# Altium project SynchroLightSlave_V2.PrjPcb
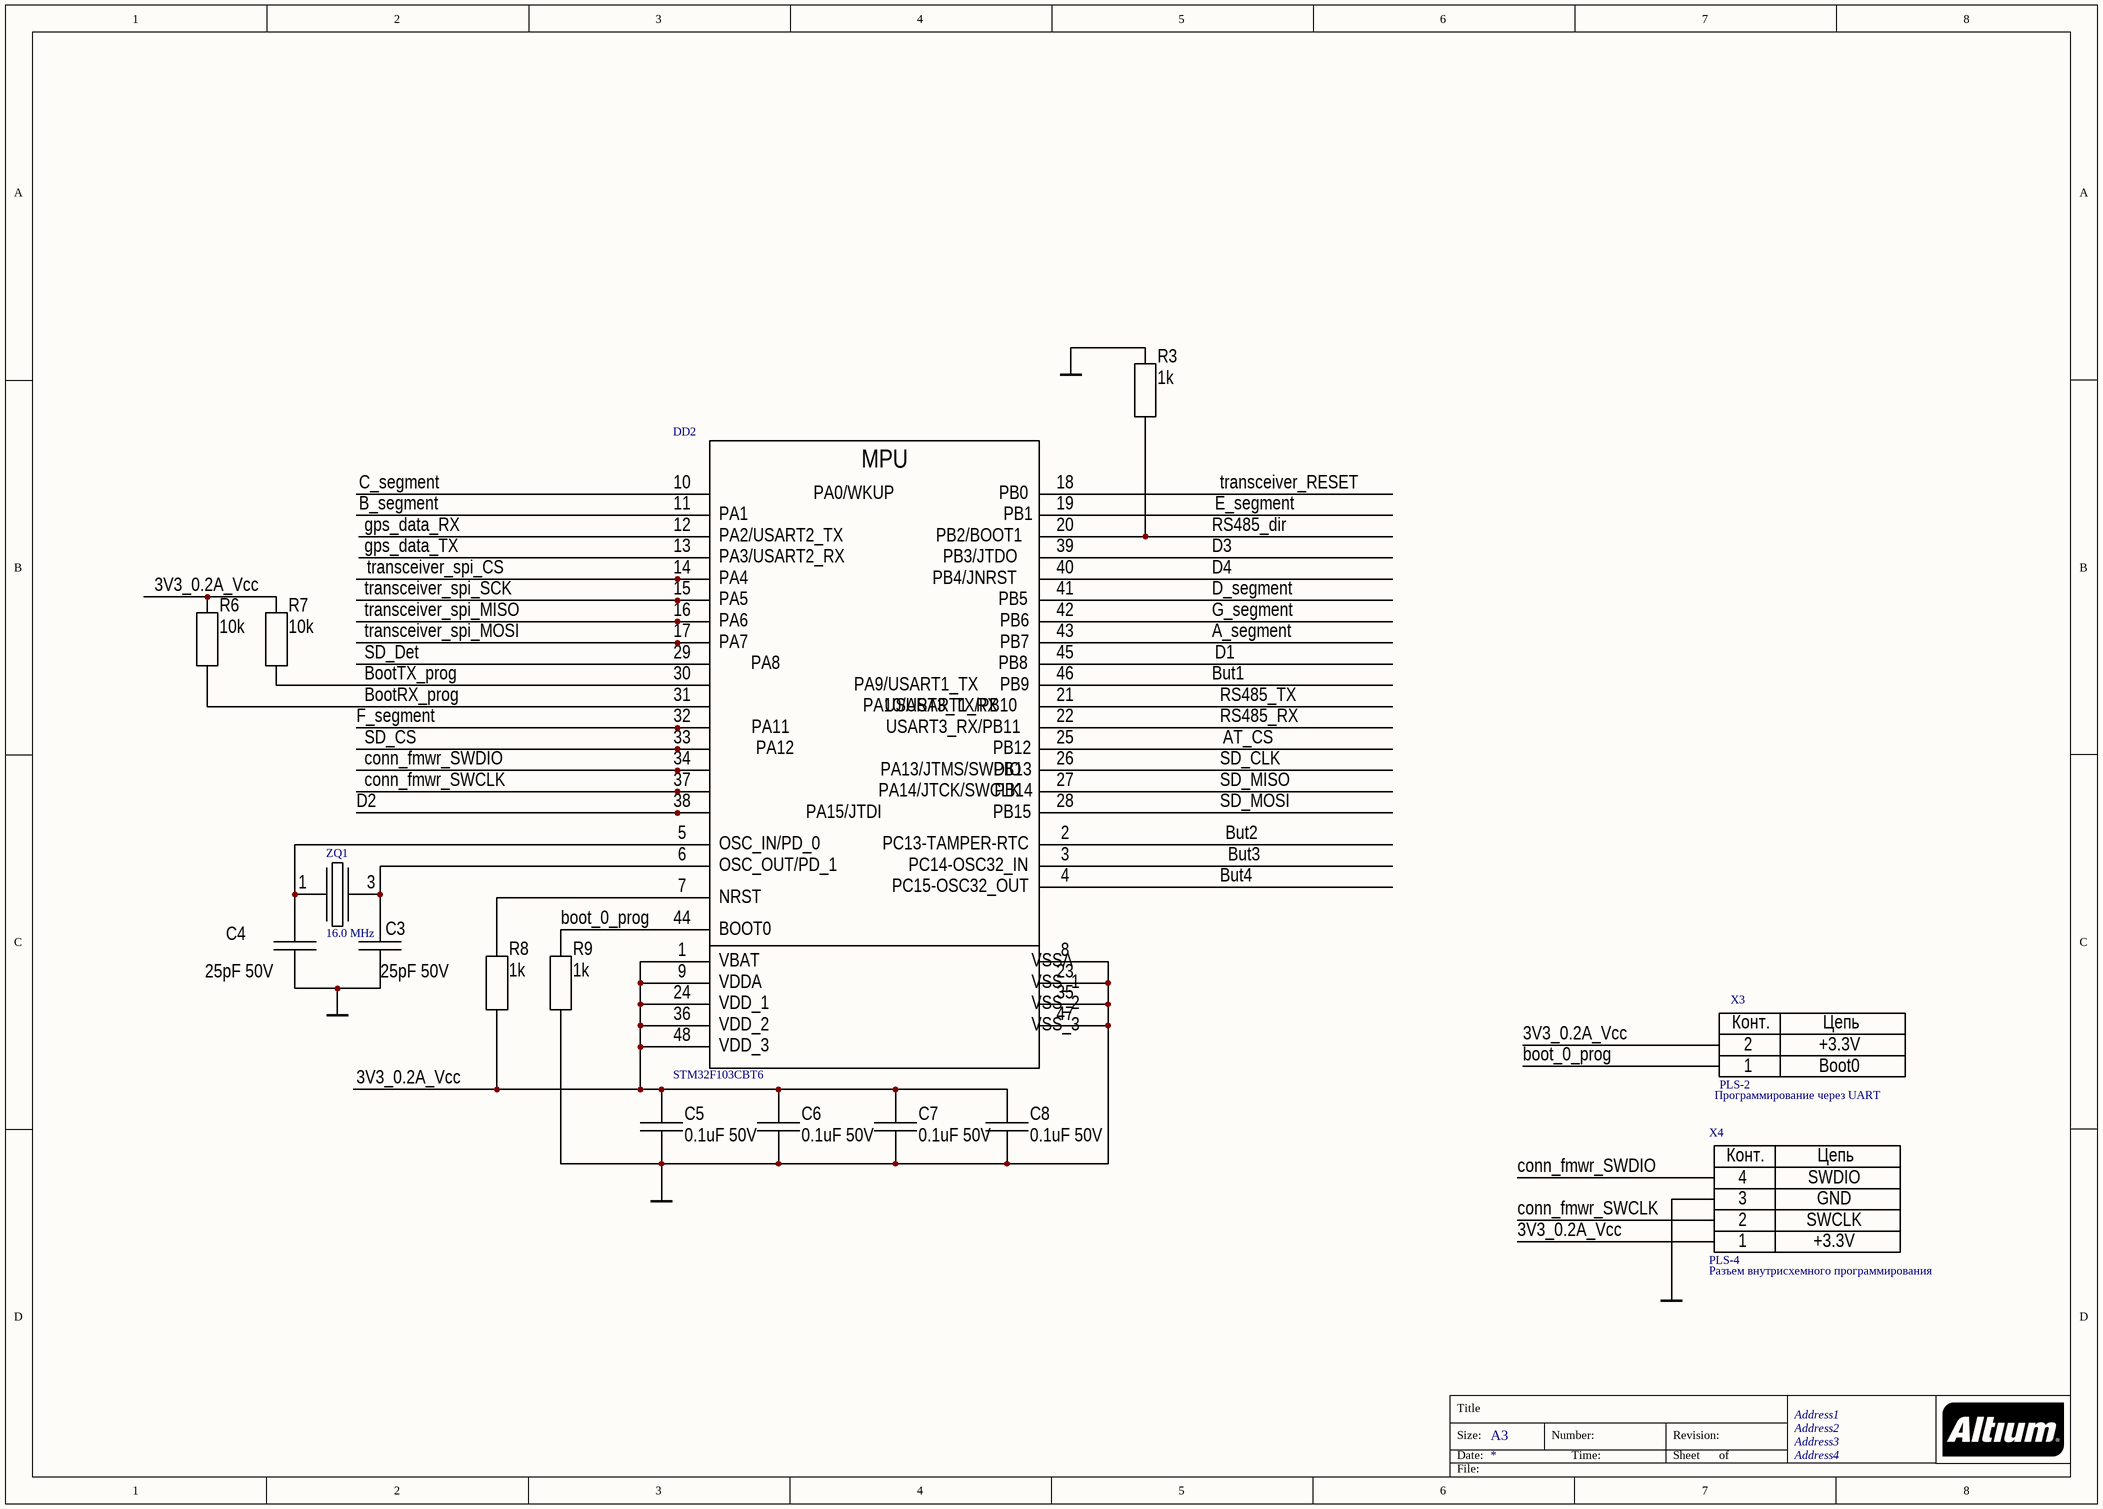
[diagram p0: MCU.SchDoc]
6 sheets, 86 parts. Net scope: global (net labels, ports and power ports of the same name join across sheets).
Board file: SynchroLightSlave_V2.PcbDoc
Sheets:
  MCU.SchDoc
  Transceiver.SchDoc
  RS485_USB.SchDoc
  LCD_SD.SchDoc
  Power.SchDoc
  Adapter.SchDoc

## Sheet MCU.SchDoc
size A3; Address1: Address1; Address2: Address2; Address3: Address3; Address4: Address4

### Parts
C3  25pF 50V  [0805_CAP]
C4  25pF 50V  [0805_CAP]
C5  0.1uF 50V  [0805_CAP]
C6  0.1uF 50V  [0805_CAP]
C7  0.1uF 50V  [0805_CAP]
C8  0.1uF 50V  [0805_CAP]
DD2  STM32F103CBT6  [Lqfp-48]
R3  1k  [0805_RES]
R6  10k  [0805_RES]
R7  10k  [0805_RES]
R8  1k  [0805_RES]
R9  1k  [0805_RES]
X3  PLS-2  Destiny: Программирование через UART  [PLS-2-2.54]
X4  PLS-4  Destiny: Разъем внутрисхемного программирования  [PLS-4-2.54]
ZQ1  16.0 MHz  [HC-49]

### Nets
GND: C3.1 C4.1 C5.1 C6.1 C7.1 C8.1 DD2.8 DD2.23 DD2.35 DD2.47 R3.2 R9.1 X4.3
3V3_0.2A_Vcc: C5.2 C6.2 C7.2 C8.2 DD2.1 DD2.9 DD2.24 DD2.36 DD2.48 R6.2 R7.2 R8.1 X3.2 X4.1
A_segment: DD2.43
AT_CS: DD2.25
B_segment: DD2.11
boot_0_prog: DD2.44 R9.2 X3.1
BootRX_prog: DD2.31 R6.1
BootTX_prog: DD2.30 R7.1
But1: DD2.46
But2: DD2.2
But3: DD2.3
But4: DD2.4
C_segment: DD2.10
conn_fmwr_SWCLK: DD2.37 X4.2
conn_fmwr_SWDIO: DD2.34 X4.4
D1: DD2.45
D2: DD2.38
D3: DD2.39
D4: DD2.40
D_segment: DD2.41
E_segment: DD2.19
F_segment: DD2.32
G_segment: DD2.42
gps_data_RX: DD2.12
gps_data_TX: DD2.13
RS485_dir: DD2.20 R3.1
RS485_RX: DD2.22
RS485_TX: DD2.21
SD_CLK: DD2.26
SD_CS: DD2.33
SD_Det: DD2.29
SD_MISO: DD2.27
SD_MOSI: DD2.28
transceiver_RESET: DD2.18
transceiver_spi_CS: DD2.14
transceiver_spi_MISO: DD2.16
transceiver_spi_MOSI: DD2.17
transceiver_spi_SCK: DD2.15
NetC3_2: C3.2 DD2.6 ZQ1.3
NetC4_2: C4.2 DD2.5 ZQ1.1
NetDD2_7: DD2.7 R8.2

### Notes on the sheet
- Title
- Size:
- Date:
- A3
- Number:
- Time:
- Revision:
- Sheet
- of
- File:
- (in symbol 2pin_conn) Конт.; Цепь
- (in symbol 4pin_conn) Конт.; Цепь
- (in symbol STM32F103-48) MPU; PA0/WKUP; PB0; PA1; PB1; PA2/USART2_TX; PB2/BOOT1; PA3/USART2_RX; PB3/JTDO; PA4; PB4/JNRST; PA5; PB5; PA6; PB6; PA7; PB7; PA8; PB8; PA9/USART1_TX; PB9; PA10/USART1_RX; USART3_TX/PB10; PA11; USART3_RX/PB11; PA12; PB12; PA13/JTMS/SWDIO; PB13; PA14/JTCK/SWCLK; PB14; PA15/JTDI; PB15; OSC_IN/PD_0; PC13-TAMPER-RTC; OSC_OUT/PD_1; PC14-OSC32_IN; PC15-OSC32_OUT; NRST; BOOT0; VBAT; VSSA; VDDA; VSS_1; VDD_1; VSS_2; VDD_2; VSS_3; VDD_3

### Library data of the parts
C3-C8 = Cap_np
  C3 C4: Value: 25pF 50V
  C5-C8: Value: 0.1uF 50V
DD2 = STM32F103-48: Value: STM32F103CBT6
R3 R6-R9 = Res
  R3 R8 R9: Value: 1k
  R6 R7: Value: 10k
X3 = 2pin_conn: PinName2: +3.3V; PinName1: Boot0; Value: PLS-2
X4 = 4pin_conn: PinName1: +3.3V; PinName2: SWCLK; PinName3: GND; PinName4: SWDIO; Value: PLS-4
ZQ1 = Cristall: Value: 16.0 MHz

## Sheet Transceiver.SchDoc
size A3; Address1: Address1; Address2: Address2; Address3: Address3; Address4: Address4
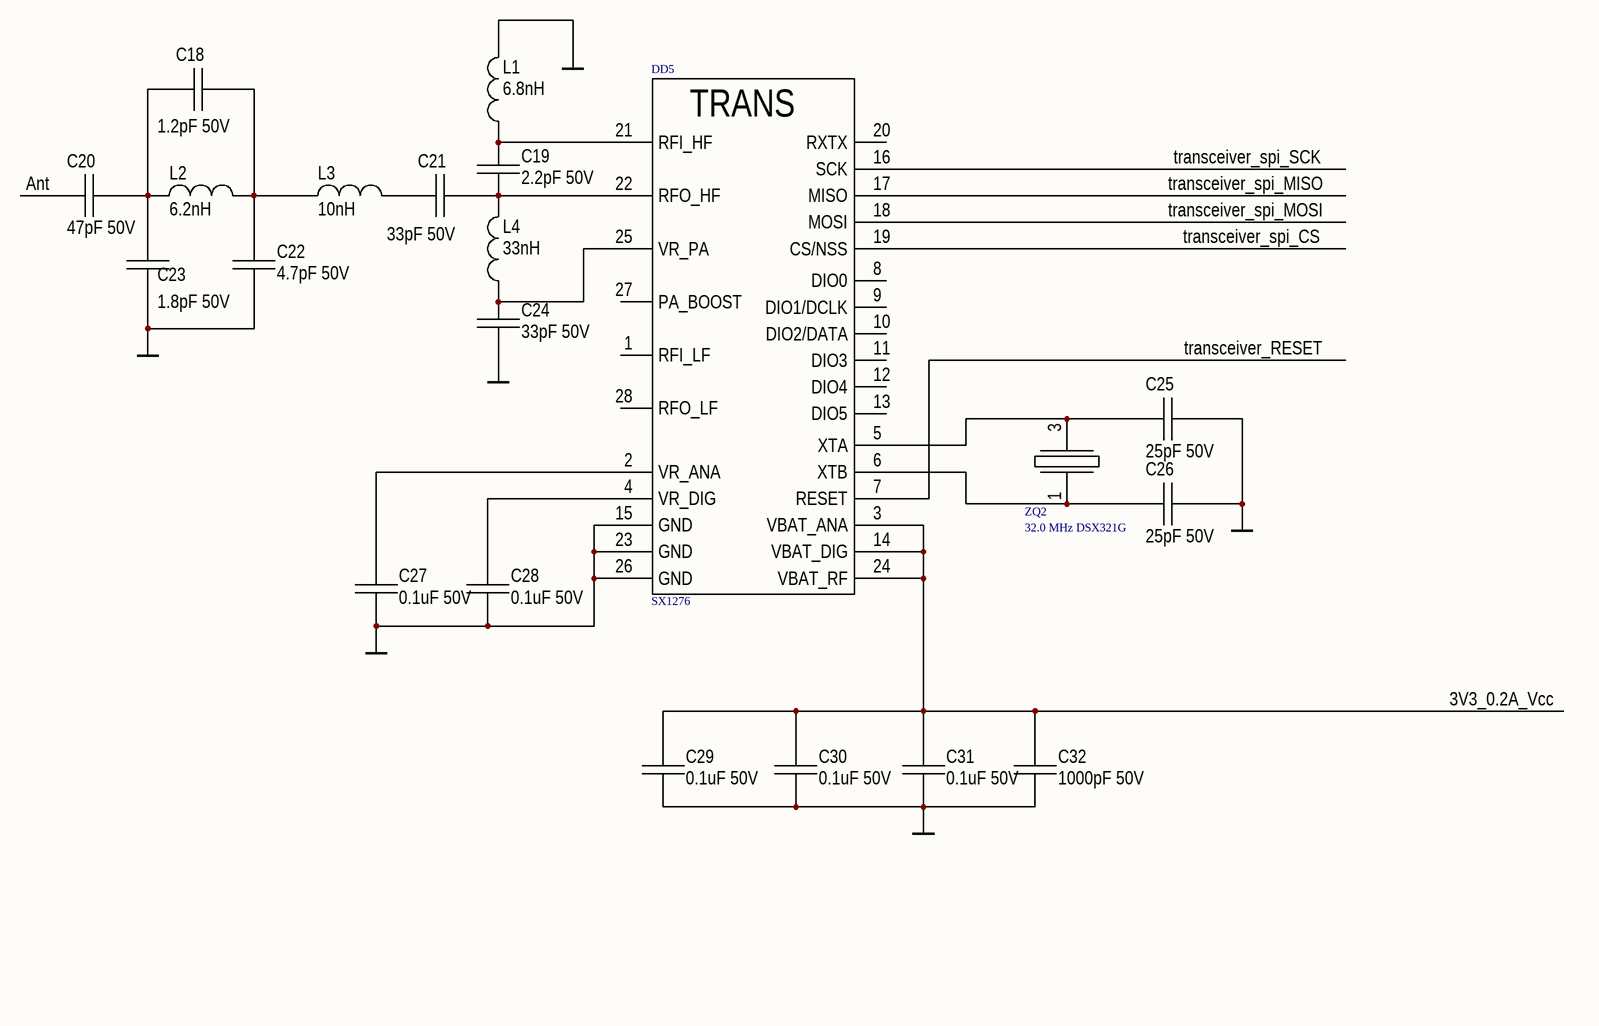
[diagram p1: Transceiver.SchDoc]

### Parts
C18  1.2pF 50V  [0603_CAP]
C19  2.2pF 50V  [0603_CAP]
C20  47pF 50V  [0603_CAP]
C21  33pF 50V  [0603_CAP]
C22  4.7pF 50V  [0603_CAP]
C23  1.8pF 50V  [0603_CAP]
C24  33pF 50V  [0603_CAP]
C25  25pF 50V  [0805_CAP]
C26  25pF 50V  [0805_CAP]
C27  0.1uF 50V  [0805_CAP]
C28  0.1uF 50V  [0805_CAP]
C29  0.1uF 50V  [0805_CAP]
C30  0.1uF 50V  [0805_CAP]
C31  0.1uF 50V  [0805_CAP]
C32  1000pF 50V  [0805_CAP]
DD5  SX1276  [qfn28]
L1  6.8nH  [0603_ind]
L2  6.2nH  [0603_ind]
L3  10nH  [0603_ind]
L4  33nH  [0603_ind]
ZQ2  32.0 MHz DSX321G  [gtxo-93]

### Nets
GND: C22.2 C23.1 C24.2 C25.2 C26.2 C27.1 C28.2 C29.2 C30.2 C31.2 C32.2 DD5.15(GND) DD5.23(GND) DD5.26(GND) L1.2
3V3_0.2A_Vcc: C29.1 C30.1 C31.1 C32.1 DD5.3(VBAT_ANA) DD5.14(VBAT_DIG) DD5.24(VBAT_RF)
Ant: C20.2
transceiver_RESET: DD5.7(RESET)
transceiver_spi_CS: DD5.19(CS/NSS)
transceiver_spi_MISO: DD5.17(MISO)
transceiver_spi_MOSI: DD5.18(MOSI)
transceiver_spi_SCK: DD5.16(SCK)
NetC18_1: C18.1 C20.1 C23.2 L2.1
NetC18_2: C18.2 C22.1 L2.2 L3.1
NetC19_1: C19.1 C21.1 DD5.22(RFO_HF) L4.2
NetC19_2: C19.2 DD5.21(RFI_HF) L1.1
NetC21_2: C21.2 L3.2
NetC24_1: C24.1 DD5.25(VR_PA) L4.1
NetC25_1: C25.1 DD5.5(XTA) ZQ2.3
NetC26_1: C26.1 DD5.6(XTB) ZQ2.1
NetC27_2: C27.2 DD5.2(VR_ANA)
NetC28_1: C28.1 DD5.4(VR_DIG)

Not connected (* = marked no-connect by the designer): DD5 1(RFI_LF) 8(DIO0) 9(DIO1/DCLK) 10(DIO2/DATA) 11(DIO3) 12(DIO4) 13(DIO5) 20(RXTX) 27(PA_BOOST) 28(RFO_LF)

### Notes on the sheet
- На место компонента С6 запаивается перемычка
- Title
- Size:
- Date:
- A3
- Number:
- Time:
- Revision:
- Sheet
- of
- File:
- (in symbol SX1276) TRANS

### Library data of the parts
C18-C32 = Cap_np
  C18: Value: 1.2pF 50V
  C19: Value: 2.2pF 50V
  C20: Value: 47pF 50V
  C21 C24: Value: 33pF 50V
  C22: Value: 4.7pF 50V
  C23: Value: 1.8pF 50V
  C25 C26: Value: 25pF 50V
  C27-C31: Value: 0.1uF 50V
  C32: Value: 1000pF 50V
L1-L4 = Inductor
  L1: Value: 6.8nH
  L2: Value: 6.2nH
  L3: Value: 10nH
  L4: Value: 33nH
ZQ2 = Cristall: Value: 32.0 MHz DSX321G
DD5 = SX1276: Value: SX1276

## Sheet RS485_USB.SchDoc
size A3; Address1: Address1; Address2: Address2; Address3: Address3; Address4: Address4
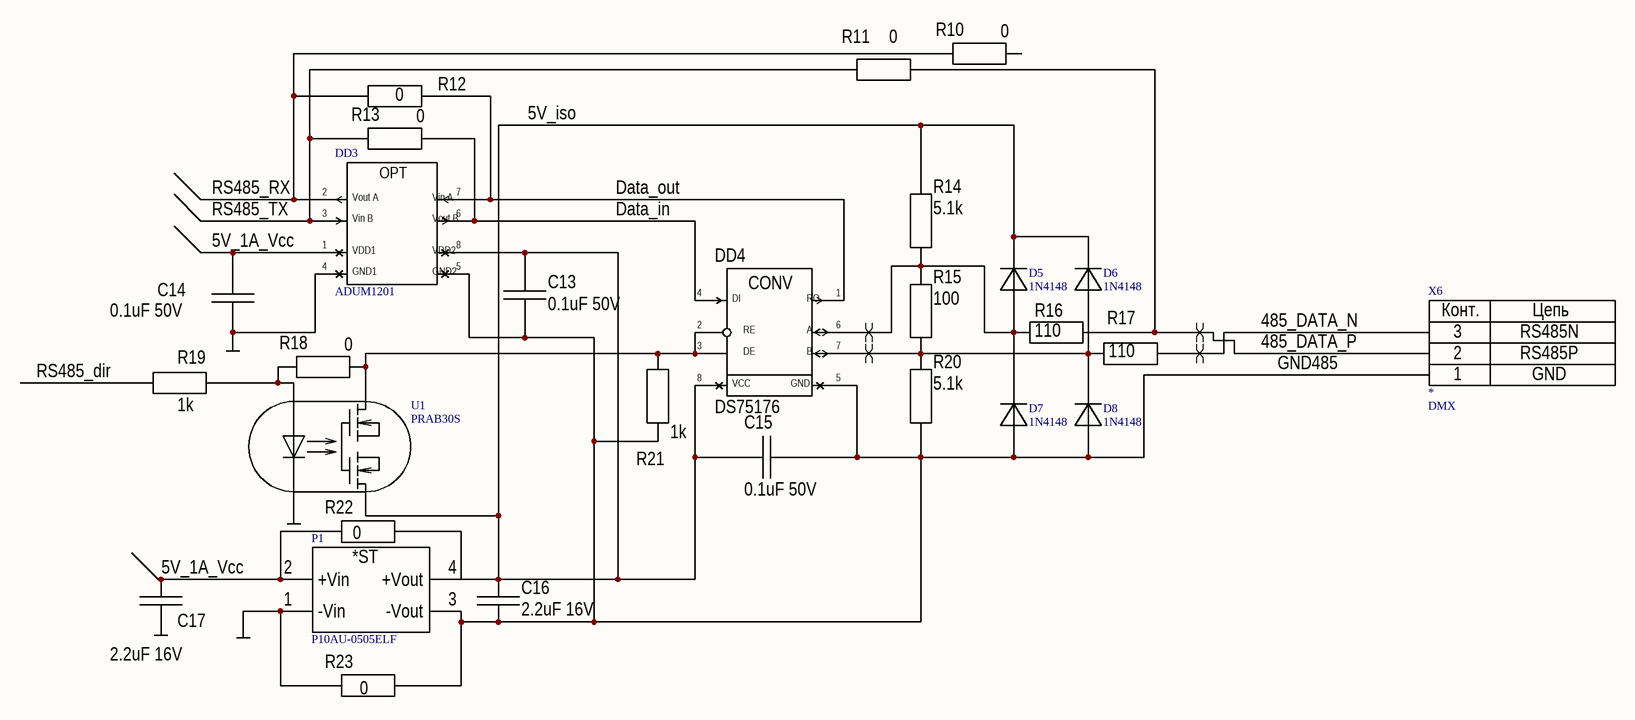
[diagram p2: RS485_USB.SchDoc]

### Parts
C13  0.1uF 50V  [0805_CAP]
C14  0.1uF 50V  [0805_CAP]
C15  0.1uF 50V  [0805_CAP]
C16  2.2uF 16V  [0805_CAP]
C17  2.2uF 16V  [0805_CAP]
D5  1N4148  [sod80c]
D6  1N4148  [sod80c]
D7  1N4148  [sod80c]
D8  1N4148  [sod80c]
DD3  ADUM1201  [soic-8]
DD4  DS75176  [soic-8]
P1  P10AU-0505ELF  [SIP4]
R10  0  [0805_RES]
R11  0  [0805_RES]
R12  0  [0805_RES]
R13  0  [0805_RES]
R14  5.1k  [0805_RES]
R15  100  [0805_RES]
R16  110  [0805_RES]
R17  110  [0805_RES]
R18  0  [0805_RES]
R19  1k  [0805_RES]
R20  5.1k  [0805_RES]
R21  1k  [0805_RES]
R22  0  [0805_RES]
R23  0  [0805_RES]
U1  PRAB30S  [sop4_optocoup]
X6  *  Destiny: DMX  [3pad_5.08]

### Nets
GND: C14.2 C17.1 DD3.4 P1.1(-Vin) R23.1 U1.2(C)
5V_1A_Vcc: C14.1 C17.2 DD3.1(A1) P1.2(+Vin) R22.1
5V_iso: C13.1 C15.1 C16.2 D5.2 D6.2 DD3.8 DD4.8 P1.4(+Vout) R14.1 R22.2 U1.3(E)
485_DATA_N: R17.2 X6.3
485_DATA_P: R11.2 R16.2 X6.2
Data_in: DD3.6 DD4.4 R13.2
Data_out: DD3.7 DD4.1 R12.2
GND485: C13.2 C15.2 C16.1 D7.1 D8.1 DD3.5 DD4.5 P1.3(-Vout) R20.2 R21.2 R23.2 X6.1
RS485_dir: R19.1
RS485_RX: DD3.2 R10.1 R12.1
RS485_TX: DD3.3 R11.1 R13.1
NetD5_1: D5.1 D7.2 DD4.6 R14.2 R15.1 R16.1
NetD6_1: D6.1 D8.2 DD4.7 R15.2 R17.1 R20.1
NetDD4_2: DD4.2 DD4.3 R18.2 R21.1 U1.4(C)
NetR18_1: R18.1 R19.2 U1.1(A)

Not connected (* = marked no-connect by the designer): R10 2

### Layout directives
differential pair: 485_DATA_N, 485_DATA_P, NetD5_1, NetD6_1

### Notes on the sheet
- Title
- Size:
- Date:
- A3
- Number:
- Time:
- Revision:
- Sheet
- of
- File:
- (in symbol 3pin_conn) Конт.; Цепь
- (in symbol ADUM1201) OPT; Vout A; Vin A; Vin B; Vout B; VDD1; VDD2; GND1; GND2
- (in symbol ds75176) CONV; DI; RO; RE; A; DE; B; VCC; GND
- (in symbol P10AU) *ST

### Library data of the parts
C13-C17 = Cap_np
  C13-C15: Value: 0.1uF 50V
  C16 C17: Value: 2.2uF 16V
D5-D8 = Diode: Value: 1N4148
P1 = P10AU: Value: P10AU-0505ELF
R10-R23 = Res
  R10-R13 R18 R22 R23: Value: 0
  R14 R20: Value: 5.1k
  R15: Value: 100
  R16 R17: Value: 110
  R19 R21: Value: 1k
U1 = Opto_Realy: Value: PRAB30S
X6 = 3pin_conn: PinName1: GND; PinName2: RS485P; PinName3: RS485N; Value: *
DD3 = ADUM1201: Value: ADUM1201
DD4 = ds75176: Value: DS75176

## Sheet LCD_SD.SchDoc
size A3; Address1: Address1; Address2: Address2; Address3: Address3; Address4: Address4
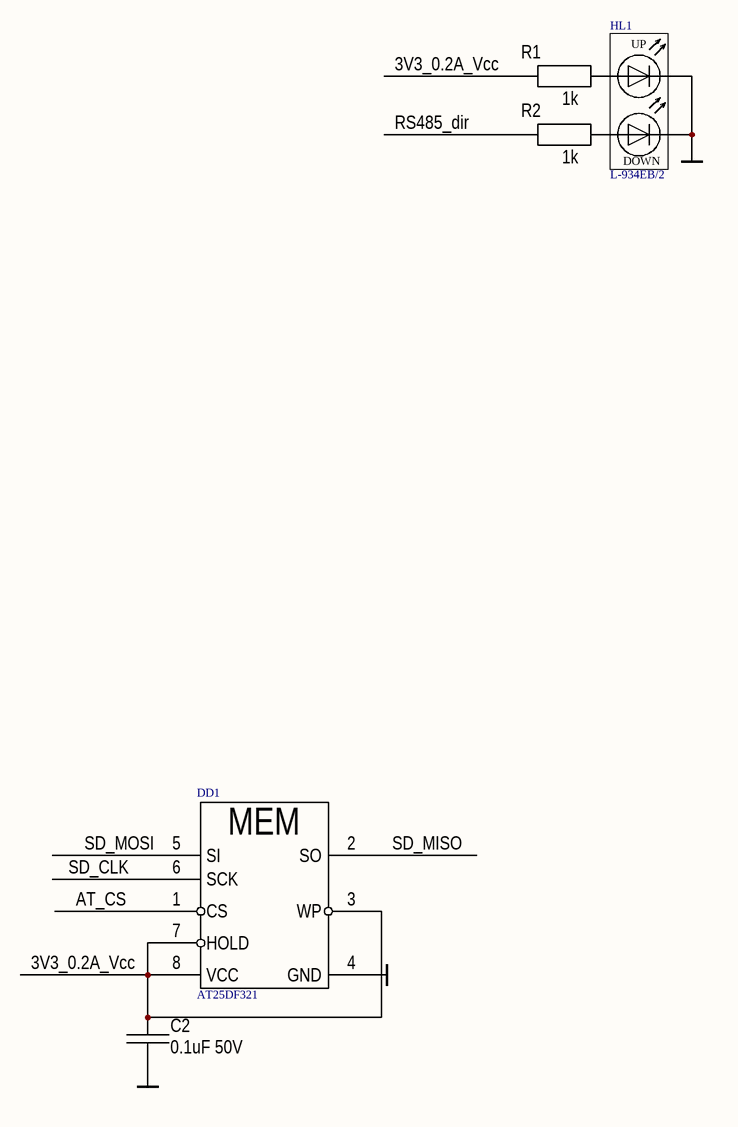
[diagram p3: LCD_SD.SchDoc]

### Parts
C2  0.1uF 50V  [0805_CAP]
DD1  AT25DF321  [soic8-200]
HL1  L-934EB/2  [L-934EB/2]
R1  1k  [0805_RES]
R2  1k  [0805_RES]

### Nets
GND: C2.2 DD1.4(GND) HL1.1 HL1.3
3V3_0.2A_Vcc: C2.1 DD1.3(WP) DD1.7(HOLD) DD1.8(VCC) R1.2
AT_CS: DD1.1(CS)
RS485_dir: R2.2
SD_CLK: DD1.6(SCK)
SD_MISO: DD1.2(SO)
SD_MOSI: DD1.5(SI)
NetHL1_2: HL1.2 R2.1
NetHL1_4: HL1.4 R1.1

### Notes on the sheet
- Title
- Size:
- Date:
- A3
- Number:
- Time:
- Revision:
- Sheet
- of
- File:
- (in symbol AT25DF321) MEM
- (in symbol LEDx2) UP; DOWN

### Library data of the parts
C2 = Cap_np: Value: 0.1uF 50V
HL1 = LEDx2: Value: L-934EB/2
R1 R2 = Res: Value: 1k
DD1 = AT25DF321: Value: AT25DF321

## Sheet Power.SchDoc
size A4
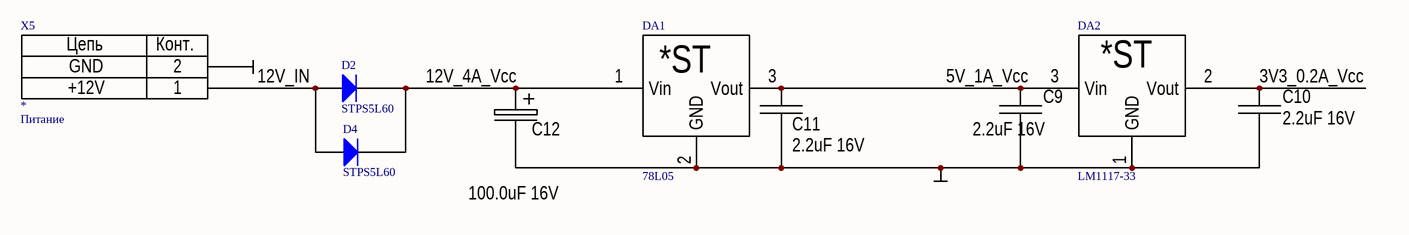
[diagram p4: Power.SchDoc]

### Parts
C9  2.2uF 16V  [0805_CAP]
C10  2.2uF 16V  [0805_CAP]
C11  2.2uF 16V  [0805_CAP]
C12  100.0uF 16V  [CAP_P_8mm_3.5mm]
D2  STPS5L60  [SMC]
D4  STPS5L60  [SMC]
DA1  78L05  [to-220ab]
DA2  LM1117-33  [dpack]
X5  *  Destiny: Питание  [2pin_5.08]

### Nets
GND: C9.1 C10.1 C11.1 C12.2 DA1.2(GND) DA2.1(GND) X5.2
3V3_0.2A_Vcc: C10.2 DA2.2(Vout)
5V_1A_Vcc: C9.2 C11.2 DA1.3(Vout) DA2.3(Vin)
12V_4A_Vcc: C12.1 D2.2(K) D4.2(K) DA1.1(Vin)
12V_IN: D2.1(A) D4.1(A) X5.1

### Notes on the sheet
- (in symbol 2pin_conn) Цепь; Конт.
- (in symbol 78L05) *ST
- (in symbol LM1117) *ST

### Library data of the parts
C9-C11 = Cap_np: Value: 2.2uF 16V
C12 = Cap_p: Group: Passive; Value: 100.0uF 16V
D2 D4 = Diode: Default Diode; Published: 8-Jun-2000; LatestRevisionDate: 17-Jul-2002; LatestRevisionNote: Re-released for DXP Platform.; PackageVersion: Sep-1996; PackageReference: SMC; Publisher: Altium Limited; PackageDescription: DO-214-AB/SMC; 2 C-Bend Leads; Body 7.9 x 5.9 mm, inc. leads (LxW); Code_JEDEC: DO-214-AB
DA2 = LM1117: Value: LM1117-33
X5 = 2pin_conn: PinName2: GND; PinName1: +12V; Value: *
DA1 = 78L05: Value: 78L05

## Sheet Adapter.SchDoc
size A3; Address1: Address1; Address2: Address2; Address3: Address3; Address4: Address4
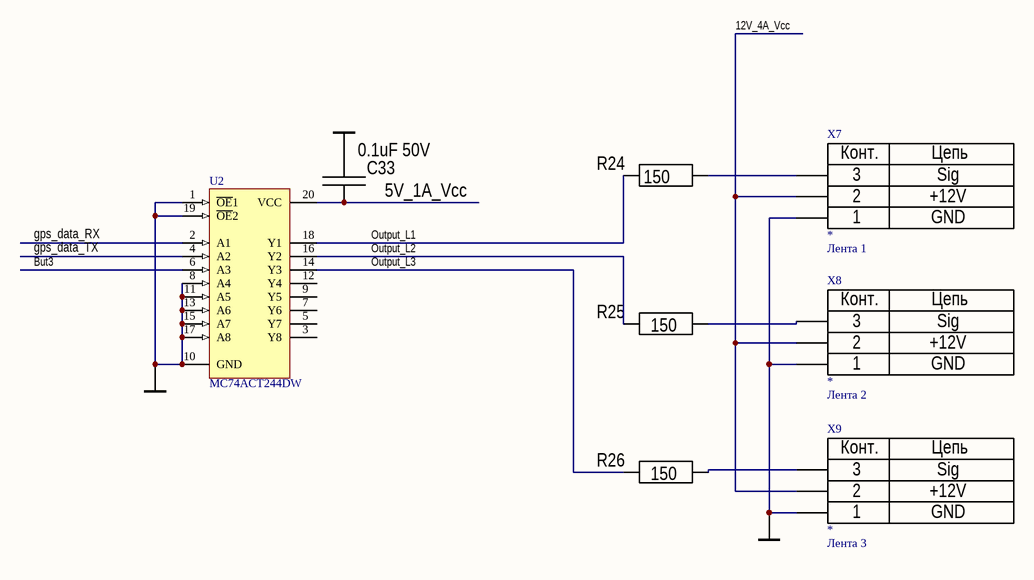
[diagram p5: Adapter.SchDoc]

### Parts
C33  0.1uF 50V  [0805_CAP]
R24  150  [0805_RES]
R25  150  [0805_RES]
R26  150  [0805_RES]
U2  MC74ACT244DW  [751D-04_N]
X7  *  Destiny: Лента 1  [3pad_5.08]
X8  *  Destiny: Лента 2  [3pad_5.08]
X9  *  Destiny: Лента 3  [3pad_5.08]

### Nets
GND: C33.2 U2.1(~{OE}1) U2.8(A4) U2.10(GND) U2.11(A5) U2.13(A6) U2.15(A7) U2.17(A8) U2.19(~{OE}2) X7.1 X8.1 X9.1
5V_1A_Vcc: C33.1 U2.20(VCC)
12V_4A_Vcc: X7.2 X8.2 X9.2
But3: U2.6(A3)
gps_data_RX: U2.2(A1)
gps_data_TX: U2.4(A2)
Output_L1: R24.1 U2.18(Y1)
Output_L2: R25.1 U2.16(Y2)
Output_L3: R26.1 U2.14(Y3)
NetR24_2: R24.2 X7.3
NetR25_2: R25.2 X8.3
NetR26_2: R26.2 X9.3

Not connected (* = marked no-connect by the designer): U2 3(Y8) 5(Y7) 7(Y6) 9(Y5) 12(Y4)

### Notes on the sheet
- Title
- Size:
- Date:
- A3
- Number:
- Time:
- Revision:
- Sheet
- of
- File:
- (in symbol 3pin_conn) Конт.; Цепь

### Library data of the parts
C33 = Cap_np: Value: 0.1uF 50V
R24-R26 = Res: Value: 150
U2 = MC74ACT244DW: Octal Buffer/Line Driver with 3-State Outputs; Published: 15-Apr-2002; LatestRevisionDate: 13-Apr-2006; LatestRevisionNote: IPC-7351 Footprint Added.; DatasheetVersion: 9-Apr-1996; PackageReference: 751D-04; Publisher: Altium Limited; PackageDescription: 20-Pin Small Outline Integrated Circuit 1.27 mm Pitch; ComponentLink1Description: Manufacturer Link; ComponentLink1URL: http://www.onsemi.com/; ComponentLink2Description: Datasheet; ComponentLink2URL: http://www.onsemi.com/pub/Collateral/MC74AC244-D.PDF
X7-X9 = 3pin_conn: PinName1: GND; PinName2: +12V; PinName3: Sig; Value: *

## Nets that join several sheets
GND: MCU (13 pins), Transceiver (15 pins), RS485_USB (6 pins), LCD_SD (C2.2 DD1.4 HL1.1 HL1.3), Power (7 pins), Adapter (12 pins)
3V3_0.2A_Vcc: MCU (14 pins), Transceiver (7 pins), LCD_SD (5 pins), Power (C10.2 DA2.2)
5V_1A_Vcc: RS485_USB (5 pins), Power (C9.2 C11.2 DA1.3 DA2.3), Adapter (C33.1 U2.20)
12V_4A_Vcc: Power (C12.1 D2.2 D4.2 DA1.1), Adapter (X7.2 X8.2 X9.2)
AT_CS: MCU (DD2.25), LCD_SD (DD1.1)
But3: MCU (DD2.3), Adapter (U2.6)
gps_data_RX: MCU (DD2.12), Adapter (U2.2)
gps_data_TX: MCU (DD2.13), Adapter (U2.4)
RS485_dir: MCU (DD2.20 R3.1), RS485_USB (R19.1), LCD_SD (R2.2)
RS485_RX: MCU (DD2.22), RS485_USB (DD3.2 R10.1 R12.1)
RS485_TX: MCU (DD2.21), RS485_USB (DD3.3 R11.1 R13.1)
SD_CLK: MCU (DD2.26), LCD_SD (DD1.6)
SD_MISO: MCU (DD2.27), LCD_SD (DD1.2)
SD_MOSI: MCU (DD2.28), LCD_SD (DD1.5)
transceiver_RESET: MCU (DD2.18), Transceiver (DD5.7)
transceiver_spi_CS: MCU (DD2.14), Transceiver (DD5.19)
transceiver_spi_MISO: MCU (DD2.16), Transceiver (DD5.17)
transceiver_spi_MOSI: MCU (DD2.17), Transceiver (DD5.18)
transceiver_spi_SCK: MCU (DD2.15), Transceiver (DD5.16)